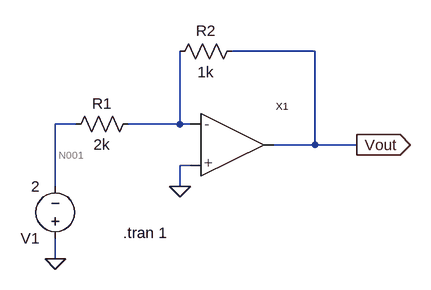
[diagram p0: schematic Draft1.asc]
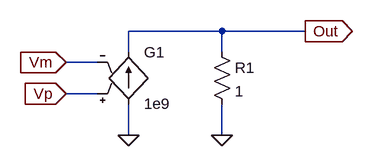
[diagram p1: sub-circuit op_amp.asc]
Draft1.asc, the LTspice schematic file:
Version 4
SHEET 1 880 680
WIRE 320 -64 192 -64
WIRE -48 48 -80 48
WIRE 112 48 112 -64
WIRE 112 48 32 48
WIRE 128 48 112 48
WIRE 320 80 320 -64
WIRE 320 80 256 80
WIRE 384 80 320 80
WIRE 128 112 112 112
WIRE -80 144 -80 48
WIRE 112 144 112 112
WIRE -80 256 -80 224
FLAG 112 144 0
FLAG -80 256 0
FLAG 384 80 Vout
IOPIN 384 80 Out
SYMBOL op_amp 144 80 R0
SYMATTR InstName X1
SYMBOL res 48 32 R90
WINDOW 0 0 56 VBottom 2
WINDOW 3 32 56 VTop 2
SYMATTR InstName R1
SYMATTR Value 2k
SYMBOL res 208 -80 R90
WINDOW 0 0 56 VBottom 2
WINDOW 3 32 56 VTop 2
SYMATTR InstName R2
SYMATTR Value 1k
SYMBOL voltage -80 240 R180
WINDOW 123 0 0 Left 0
WINDOW 39 0 0 Left 0
SYMATTR InstName V1
SYMATTR Value 2
TEXT 24 216 Left 2 !.tran 1

op_amp.asc, the sub-circuit schematic file:
Version 4
SHEET 1 880 680
WIRE 304 176 160 176
WIRE 432 176 304 176
WIRE 160 208 160 176
WIRE 304 208 304 176
WIRE 112 224 64 224
WIRE 112 272 64 272
WIRE 160 336 160 288
WIRE 304 336 304 288
FLAG 160 336 0
FLAG 304 336 0
FLAG 64 224 Vm
IOPIN 64 224 In
FLAG 64 272 Vp
IOPIN 64 272 In
FLAG 432 176 Out
IOPIN 432 176 Out
SYMBOL g2 160 192 R0
SYMATTR InstName G1
SYMATTR Value 1e9
SYMBOL res 288 192 R0
SYMATTR InstName R1
SYMATTR Value 1

The netlist it stands for:
* Draft1.asc
XX1 N002 0 Vout op_amp
R1 N002 N001 2k
R2 Vout N002 1k
V1 0 N001 2

* block symbol definitions
.subckt op_amp Vm Vp Out
G1 0 Out Vp Vm 1e9
R1 Out 0 1
.ends op_amp

.tran 1
.backanno
.end

* Results of the author's LTspice run, read from the files saved beside the schematic
* Operating Point, zero values left out:
*   V(vout) = 1 V
*   V(n001) = -2 V
*   I(R1) = 1 mA
*   I(R2) = 1 mA
*   I(V1) = -1 mA
*   Ix(x1:OUT) = -1 mA